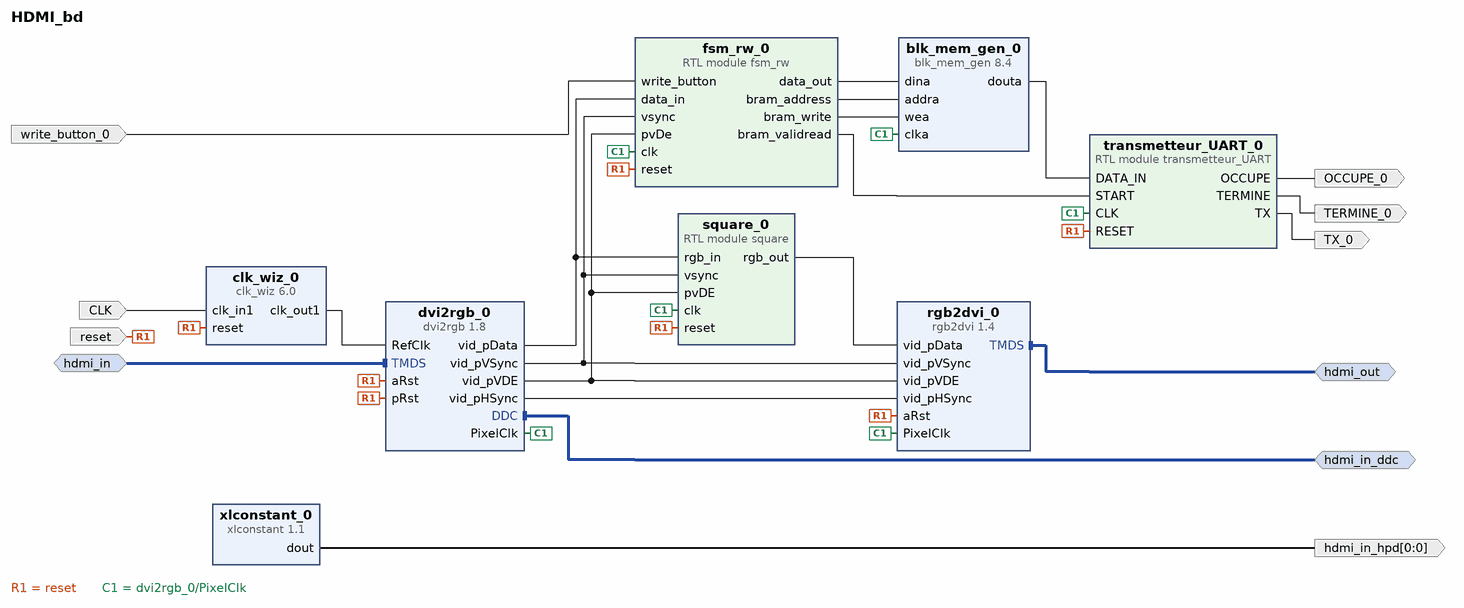
[diagram p0: block diagram of the top level]
# Vivado block design HDMI_bd, xc7z020clg400-1, Vivado 2018.2.1
create_bd_design HDMI_bd

create_bd_intf_port -mode Slave -vlnv digilentinc.com:interface:tmds_rtl:1.0 hdmi_in
create_bd_intf_port -mode Master -vlnv xilinx.com:interface:iic_rtl:1.0 hdmi_in_ddc
create_bd_intf_port -mode Master -vlnv digilentinc.com:interface:tmds_rtl:1.0 hdmi_out
create_bd_port -dir I -type clk CLK
set_property -dict {CONFIG.FREQ_HZ 125000000} [get_bd_ports CLK]
create_bd_port -dir I -type rst reset
set_property -dict {CONFIG.POLARITY ACTIVE_HIGH} [get_bd_ports reset]
create_bd_port -dir O -from 0 -to 0 hdmi_in_hpd
create_bd_port -dir I write_button_0
create_bd_port -dir O OCCUPE_0
create_bd_port -dir O TERMINE_0
create_bd_port -dir O TX_0

create_bd_cell -type ip -vlnv xilinx.com:ip:clk_wiz:6.0 clk_wiz_0
set_property -dict [list \
  CONFIG.PRIMITIVE PLL \
  CONFIG.PRIM_IN_FREQ 125.000 \
  CONFIG.CLKIN1_JITTER_PS 80.0 \
  CONFIG.CLKOUT1_REQUESTED_OUT_FREQ 200.000 \
  CONFIG.CLKOUT1_DRIVES BUFG \
  CONFIG.CLKOUT2_DRIVES BUFG \
  CONFIG.CLKOUT3_DRIVES BUFG \
  CONFIG.CLKOUT4_DRIVES BUFG \
  CONFIG.CLKOUT5_DRIVES BUFG \
  CONFIG.CLKOUT6_DRIVES BUFG \
  CONFIG.CLKOUT7_DRIVES BUFG \
  CONFIG.MMCM_DIVCLK_DIVIDE 1 \
  CONFIG.MMCM_CLKFBOUT_MULT_F 8 \
  CONFIG.MMCM_CLKIN1_PERIOD 8.000 \
  CONFIG.MMCM_CLKIN2_PERIOD 10.0 \
  CONFIG.MMCM_COMPENSATION ZHOLD \
  CONFIG.MMCM_CLKOUT0_DIVIDE_F 5 \
  CONFIG.CLKOUT1_JITTER 109.241 \
  CONFIG.CLKOUT1_PHASE_ERROR 96.948 \
] [get_bd_cells clk_wiz_0]
create_bd_cell -type ip -vlnv digilentinc.com:ip:dvi2rgb:1.8 dvi2rgb_0
create_bd_cell -type ip -vlnv digilentinc.com:ip:rgb2dvi:1.4 rgb2dvi_0
set_property -dict {CONFIG.kClkPrimitive MMCM CONFIG.kClkRange 3} [get_bd_cells rgb2dvi_0]
create_bd_cell -type ip -vlnv xilinx.com:ip:xlconstant:1.1 xlconstant_0
create_bd_cell -type ip -vlnv xilinx.com:ip:blk_mem_gen:8.4 blk_mem_gen_0
set_property -dict [list \
  CONFIG.Enable_32bit_Address false \
  CONFIG.Use_Byte_Write_Enable false \
  CONFIG.Write_Width_A 24 \
  CONFIG.Write_Depth_A 190000 \
  CONFIG.Read_Width_A 24 \
  CONFIG.Enable_A Always_Enabled \
  CONFIG.Register_PortA_Output_of_Memory_Primitives true \
  CONFIG.Use_RSTA_Pin false \
  CONFIG.use_bram_block Stand_Alone \
] [get_bd_cells blk_mem_gen_0]
create_bd_cell -type module -reference fsm_rw fsm_rw_0
create_bd_cell -type module -reference square square_0
create_bd_cell -type module -reference transmetteur_UART transmetteur_UART_0

# ---- connections ----

connect_bd_intf_net [get_bd_intf_ports hdmi_in] [get_bd_intf_pins dvi2rgb_0/TMDS]
connect_bd_intf_net [get_bd_intf_ports hdmi_in_ddc] [get_bd_intf_pins dvi2rgb_0/DDC]
connect_bd_intf_net [get_bd_intf_ports hdmi_out] [get_bd_intf_pins rgb2dvi_0/TMDS]
connect_bd_net [get_bd_ports CLK] [get_bd_pins clk_wiz_0/clk_in1]
connect_bd_net [get_bd_ports reset] \
  [get_bd_pins clk_wiz_0/reset] [get_bd_pins dvi2rgb_0/aRst] [get_bd_pins dvi2rgb_0/pRst] [get_bd_pins rgb2dvi_0/aRst] \
  [get_bd_pins fsm_rw_0/reset] [get_bd_pins square_0/reset] [get_bd_pins transmetteur_UART_0/RESET]
connect_bd_net [get_bd_pins clk_wiz_0/clk_out1] [get_bd_pins dvi2rgb_0/RefClk]
connect_bd_net [get_bd_pins dvi2rgb_0/PixelClk] \
  [get_bd_pins rgb2dvi_0/PixelClk] [get_bd_pins blk_mem_gen_0/clka] [get_bd_pins fsm_rw_0/clk] [get_bd_pins square_0/clk] \
  [get_bd_pins transmetteur_UART_0/CLK]
connect_bd_net [get_bd_pins xlconstant_0/dout] [get_bd_ports hdmi_in_hpd]
connect_bd_net [get_bd_pins dvi2rgb_0/vid_pData] [get_bd_pins fsm_rw_0/data_in] [get_bd_pins square_0/rgb_in]
connect_bd_net [get_bd_pins dvi2rgb_0/vid_pVSync] [get_bd_pins rgb2dvi_0/vid_pVSync] [get_bd_pins fsm_rw_0/vsync] [get_bd_pins square_0/vsync]
connect_bd_net [get_bd_pins dvi2rgb_0/vid_pVDE] [get_bd_pins rgb2dvi_0/vid_pVDE] [get_bd_pins fsm_rw_0/pvDe] [get_bd_pins square_0/pvDE]
connect_bd_net [get_bd_pins square_0/rgb_out] [get_bd_pins rgb2dvi_0/vid_pData]
connect_bd_net [get_bd_pins dvi2rgb_0/vid_pHSync] [get_bd_pins rgb2dvi_0/vid_pHSync]
connect_bd_net -net write_button_0_1 [get_bd_ports write_button_0] [get_bd_pins fsm_rw_0/write_button]
connect_bd_net -net fsm_rw_0_rgb_out [get_bd_pins fsm_rw_0/data_out] [get_bd_pins blk_mem_gen_0/dina]
connect_bd_net [get_bd_pins fsm_rw_0/bram_address] [get_bd_pins blk_mem_gen_0/addra]
connect_bd_net [get_bd_pins fsm_rw_0/bram_write] [get_bd_pins blk_mem_gen_0/wea]
connect_bd_net [get_bd_pins blk_mem_gen_0/douta] [get_bd_pins transmetteur_UART_0/DATA_IN]
connect_bd_net [get_bd_pins transmetteur_UART_0/OCCUPE] [get_bd_ports OCCUPE_0]
connect_bd_net [get_bd_pins transmetteur_UART_0/TERMINE] [get_bd_ports TERMINE_0]
connect_bd_net [get_bd_pins transmetteur_UART_0/TX] [get_bd_ports TX_0]
connect_bd_net [get_bd_pins fsm_rw_0/bram_validread] [get_bd_pins transmetteur_UART_0/START]

validate_bd_design
save_bd_design
